# EAGLE schematic Mini Spectrometer Main Circuit (EAGLE 9.7.0)
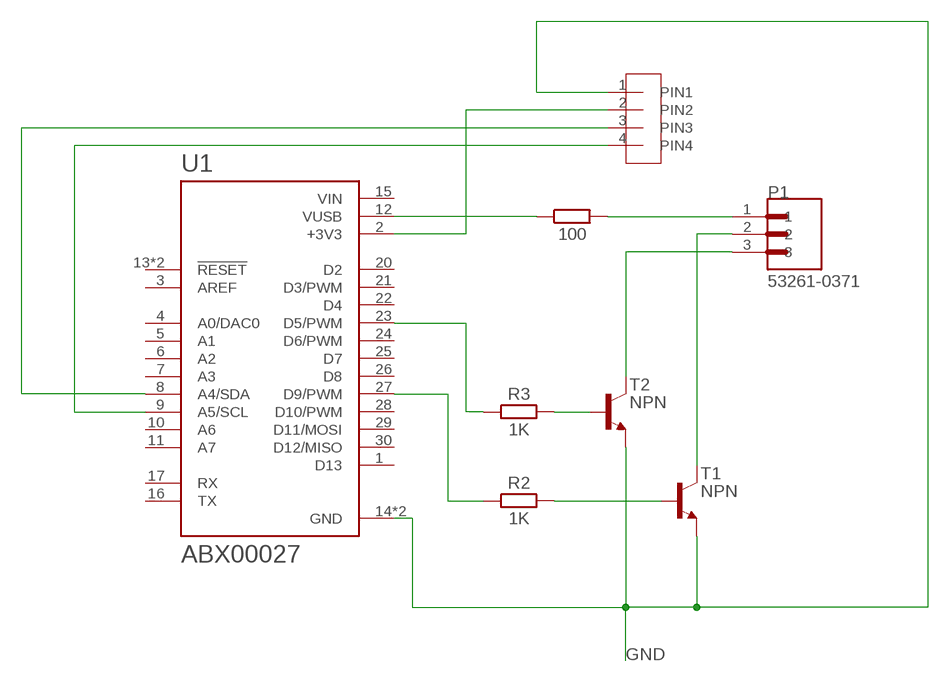
[diagram p0: schematic, sheet 1]

## Parts
J1  JST-SH-4WAY-2  [JST_SM04B-SRSS-TB_LF__SN_]
P1  53261-0371  [MOLEX_53261-0371]
R1  100  R_CHIP-1206(3216-METRIC)  [RESC3216X70]
R2  1K  R_CHIP-0402(1005-METRIC)  [RESC1005X40]
R3  1K  R_CHIP-0402(1005-METRIC)  [RESC1005X40]
T1  NPN  NPN-NICK_SOT23  [SOT95P237X112-3N]
T2  NPN  NPN-NICK_SOT23  [SOT95P237X112-3N]
U1  ABX00027  [MODULE_ABX00027]

## Nets
GND: J1.1(PIN1) T1.2(E) T2.2(E) U1.14(GND) U1.19(GND)
N$1: R1.1 U1.12(VUSB)
N$2: R2.1 U1.27(D9/PWM)
N$3: R3.1 U1.23(D5/PWM)
N$4: R2.2 T1.1(B)
N$5: R3.2 T2.1(B)
N$8: J1.2(PIN2) U1.2(+3V3)
N$9: J1.3(PIN3) U1.8(A4/SDA)
N$10: J1.4(PIN4) U1.9(A5/SCL)
N$11: P1.1 R1.2
N$13: P1.2 T1.3(C)
N$14: P1.3 T2.3(C)
Unconnected: U1.1(D13) U1.3(AREF) U1.4(A0/DAC0) U1.5(A1) U1.6(A2) U1.7(A3) U1.10(A6) U1.11(A7) U1.13(!RESET) U1.16(TX) U1.17(RX) U1.18(!RESET) U1.20(D2) U1.21(D3/PWM) U1.22(D4) U1.24(D6/PWM) U1.25(D7) U1.26(D8) U1.28(D10/PWM) U1.29(D11/MOSI) U1.30(D12/MISO)

## Power pins joined to a net without a drawn wire
VIN: U1.15(VIN)

## Library data of the parts
J1 = JST-SH-2:JST-SH-4WAY-2
P1 = 53261-0371:53261-0371: 1.25mm Pitch PicoBlade™ Header, Surface Mount, Right Angle, Lead-Free, 3 Circuits; MANUFACTURER: MOLEX
R1-R3 = Resistor:R: Resistor Fixed - Generic; CATEGORY: Resistor; SUB-CATEGORY: Fixed
T1 T2 = Transistor:NPN-NICK: NPN - Generic; CATEGORY: Transistor; SUB-CATEGORY: BJT; TYPE: NPN
U1 = ABX00027:ABX00027: ATSAMD21G18A Arduino Nano 33 IoT SAM D ARM® Cortex®-M0+ MCU 32-Bit Embedded Evaluation Board; AVAILABILITY: Unavailable; DESCRIPTION: ATSAMD21G18A Arduino Nano 33 IoT SAM D ARM® Cortex®-M0+ MCU 32-Bit Embedded Evaluation Board; DIGIKEY-PURCHASE-URL: https://snapeda.com/shop?store=DigiKey&id=3949339; MF: Arduino; MP: ABX00027; PACKAGE: None; PRICE: None